# Altium schematic sheet high_pass.SchDoc: HIGH PASS
size A4; Organization: Altium Limited; Address1: L3, 12a Rodborough Rd; Address2: Frenchs Forest; Address3: NSW; Address4: Australia 2086; DocumentNumber: 1; Revision: 1
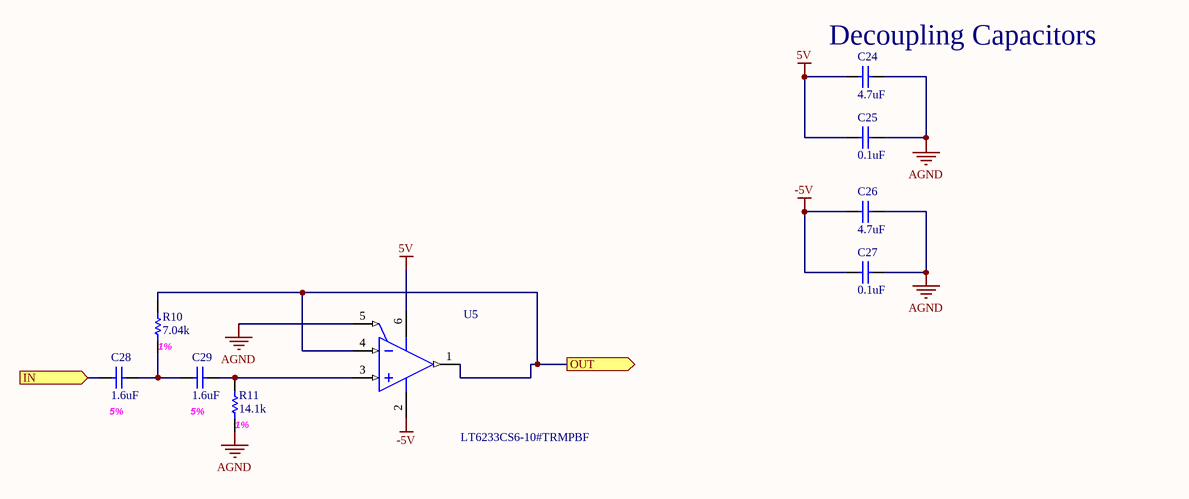
[diagram p0: high_pass.SchDoc]

## Parts
C24  4.7uF  [0402_Cap]
C25  0.1uF  [0402_Cap]
C26  4.7uF  [0402_Cap]
C27  0.1uF  [0402_Cap]
C28  1.6uF  [0402_Cap]
C29  1.6uF  [0402_Cap]
R10  7.04k  [0402_Res]
R11  14.1k  [0402_Res]
U5  LT6233CS6-10#TRMPBF  [LT-S6-6-TSOT-23_N]

## Ports
IN (in), OUT (out)

## Nets
5V: C24.1 C25.1 U5.6(V+)
-5V: C26.1 C27.1 U5.2(V-)
AGND: C24.2 C25.2 C26.2 C27.2 R11.1 U5.5(~{ENABLE})
IN: C28.1 ; port IN
OUT: R10.2 U5.1(OUT) U5.4(-IN) ; port OUT
NetC28_2: C28.2 C29.1 R10.1
NetC29_2: C29.2 R11.2 U5.3(+IN)

## Notes on the sheet
- (near C24) Decoupling Capacitors
- (near R10) 1%
- (near C28) 5%
- 5%
- (near R11) 1%
- Title
- Date:
- RE:
- Arturo di Girolamo
- Size:
- A3
- A

## Library data of the parts
C24 C26 = CL21A475KAQNNNE: Capacitor, 4.7uF, 0805; Value: .01uf; ASYPN: GRM155R61A475MEAAD; MFGPN: CL21A475KAQNNNE
C25 C27 = CL21B104KACNNNC: Capacitor, 0.1uF, 0805; Value: .01uf; ASYPN: 0402YC104KAT2A; MFGPN: CL21B104KACNNNC
C28 C29 = GRM219R71C564KA01D: Capacitor, 560nF, 0805, 25V; ASYPN: C1005X7S0J155K050BC; Value: 560nF; MFGPN: GRM219R71C564KA01D
  C28: Parameter 1: *
R10 = ERJ-PB6D7501V: 7.5K 1% 1/4W; Value: 1K; ASYPN: RN73R1ETTP7061B25; MFGPN: ERJ-PB6D7501V
R11 = RC0805FR-0714K7L: 14.7K 1% 1/4W; Value: 1K; ASYPN: ERJ-2RKF1402X; MFGPN: RC0805FR-0714K7L
U5 = CMP-0359-02439-2: Single Channel, Ultralow Noise, Low Power, High Speed Operational Amplifier, 375 MHz Typical GBW, 80 V/us Typical SR, 3 to 12.6 V, 6-Pin SOT23 (S6-6), Commercial, Pb-Free, Mini Reel; Linear Technology Part Number: LT6233; Manufacturer: Linear Technology; Vs Max (V): 12.6; Vos (mV) Guaranteed: 0.5; Vos (mV) Typical: 0.1; Channels (#): 1; Vs Min (V): 3; GBW (MHz) Typical: 60; SR (V/us) Typical: 15; Is (mA) Typical: 1.15; ComponentLink3Description: Package Specification; Type: VFB; Mounting Technology: Surface Mount; PackageDescription: 6-Pin Plastic TSOT-23, Body 2.9 x 1.63 mm, Pitch 0.95 mm; ComponentLink2URL: http://cds.linear.com/docs/en/datasheet/623345fc.pdf; ComponentLink1URL: http://www.linear.com/; Packing: Mini Reel; ComponentLink1Description: Manufacturer URL; PartNumber: LT6233CS6-10#TRMPBF; ComponentLink3URL: http://cds.linear.com/docs/en/packaging/SOT_6_05-08-1636.pdf; DatasheetVersion: Rev. C; Code_JEDEC: MO-193; RevisionNote: URLs updated; RoHS: Pb-Free; PackageReference: LT-S6-6-TSOT-23; ComponentLink2Description: Datasheet; ASYPN: LT6233CS6-10#TRMPBF